# Altium schematic sheet Memory.SchDoc
size A4; SheetNumber: 5; SheetTotal: 9
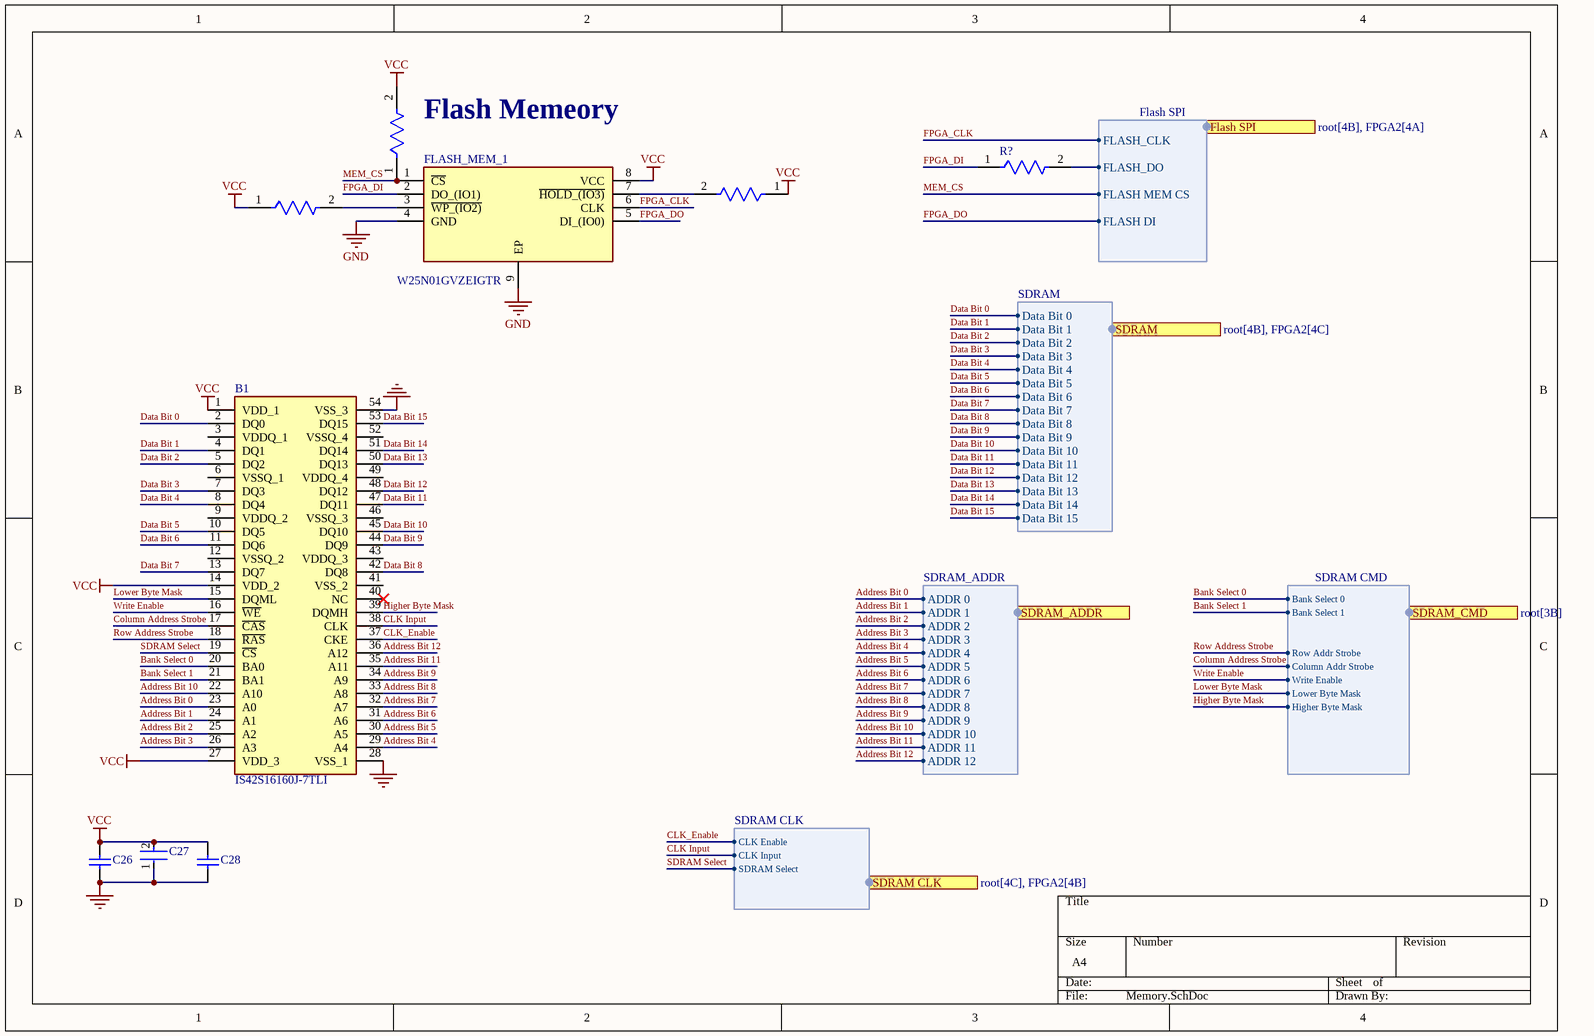
[diagram p0: Memory.SchDoc]

## Parts
(Parts that share a designator on the sheet are numbered #1, #2 ... from top to bottom, then left to right.)
B1  IS42S16160J-7TLI  [SOP80P1176X120-54N]
C26  LD033C104KAB2A  [CAPC1608X90X35NL15T15]  (value not drawn)
C27  GRM219R61E475MA73J  [FP-GRM219-0_15-0_1-IPC_B]  (value not drawn)
C28  C0603C105K9PACTU  [CAPC1608X90X35LL15T15]  (value not drawn)
FLASH_MEM_1  W25N01GVZEIGTR  [SON127P800X600X80-9N-D]
R?  RT0402BRE0750RL  [FP-RT0402-0_35-MFG]  (value not drawn)
R_?#1  RT0402BRE0710KL  [FP-RT0402-MFG]  (value not drawn)
R_?#2  RT0402BRE0710KL  [FP-RT0402-MFG]  (value not drawn)
R_?#3  RT0402BRE0710KL  [FP-RT0402-MFG]  (value not drawn)

## Ports
Flash SPI (harness Flash SPI, see root[4B], FPGA2[4A]), SDRAM (harness SDRAM, see root[4B], FPGA2[4C]), SDRAM CLK (harness SDRAM CLK, see root[4C], FPGA2[4B]), SDRAM_ADDR (harness SDRAM_ADDR, see root[4B], FPGA2[4C]), SDRAM_CMD (harness SDRAM CMD, see root[3B])

## Harnesses
Flash SPI: FLASH_CLK, FLASH_DO, FLASH MEM CS, FLASH DI
SDRAM: Data Bit 0, Data Bit 1, Data Bit 2, Data Bit 3, Data Bit 4, Data Bit 5, Data Bit 6, Data Bit 7, Data Bit 8, Data Bit 9, Data Bit 10, Data Bit 11, Data Bit 12, Data Bit 13, Data Bit 14, Data Bit 15
SDRAM_ADDR: ADDR 0, ADDR 1, ADDR 2, ADDR 3, ADDR 4, ADDR 5, ADDR 6, ADDR 7, ADDR 8, ADDR 9, ADDR 10, ADDR 11, ADDR 12
SDRAM CMD: Bank Select 0, Bank Select 1, Row Addr Strobe, Column Addr Strobe, Write Enable, Lower Byte Mask, Higher Byte Mask
SDRAM CLK: CLK Enable, CLK Input, SDRAM Select

## Nets
\: B1.1(VDD_1) B1.14(VDD_2) B1.27(VDD_3) C26.2 C27.2 C28.2 FLASH_MEM_1.8(VCC) R_?#1.2 R_?#2.1 R_?#3.1  [also labelled VCC]
GND: B1.28(VSS_1) B1.54(VSS_3) C26.1 C27.1 C28.1 FLASH_MEM_1.4(GND) FLASH_MEM_1.9(EP)
Address Bit 0: B1.23(A0) ; port SDRAM_ADDR.ADDR 0
Address Bit 1: B1.24(A1) ; port SDRAM_ADDR.ADDR 1
Address Bit 2: B1.25(A2) ; port SDRAM_ADDR.ADDR 2
Address Bit 3: B1.26(A3) ; port SDRAM_ADDR.ADDR 3
Address Bit 4: B1.29(A4) ; port SDRAM_ADDR.ADDR 4
Address Bit 5: B1.30(A5) ; port SDRAM_ADDR.ADDR 5
Address Bit 6: B1.31(A6) ; port SDRAM_ADDR.ADDR 6
Address Bit 7: B1.32(A7) ; port SDRAM_ADDR.ADDR 7
Address Bit 8: B1.33(A8) ; port SDRAM_ADDR.ADDR 8
Address Bit 9: B1.34(A9) ; port SDRAM_ADDR.ADDR 9
Address Bit 10: B1.22(A10) ; port SDRAM_ADDR.ADDR 10
Address Bit 11: B1.35(A11) ; port SDRAM_ADDR.ADDR 11
Address Bit 12: B1.36(A12) ; port SDRAM_ADDR.ADDR 12
Bank Select 0: B1.20(BA0) ; port SDRAM_CMD.Bank Select 0
Bank Select 1: B1.21(BA1) ; port SDRAM_CMD.Bank Select 1
CLK Input: B1.38(CLK) ; port SDRAM CLK.CLK Input
CLK_Enable: B1.37(CKE) ; port SDRAM CLK.CLK Enable
Column Address Strobe: B1.17(~{CAS}) ; port SDRAM_CMD.Column Addr Strobe
Data Bit 0: B1.2(DQ0) ; port SDRAM.Data Bit 0
Data Bit 1: B1.4(DQ1) ; port SDRAM.Data Bit 1
Data Bit 2: B1.5(DQ2) ; port SDRAM.Data Bit 2
Data Bit 3: B1.7(DQ3) ; port SDRAM.Data Bit 3
Data Bit 4: B1.8(DQ4) ; port SDRAM.Data Bit 4
Data Bit 5: B1.10(DQ5) ; port SDRAM.Data Bit 5
Data Bit 6: B1.11(DQ6) ; port SDRAM.Data Bit 6
Data Bit 7: B1.13(DQ7) ; port SDRAM.Data Bit 7
Data Bit 8: B1.42(DQ8) ; port SDRAM.Data Bit 8
Data Bit 9: B1.44(DQ9) ; port SDRAM.Data Bit 9
Data Bit 10: B1.45(DQ10) ; port SDRAM.Data Bit 10
Data Bit 11: B1.47(DQ11) ; port SDRAM.Data Bit 11
Data Bit 12: B1.48(DQ12) ; port SDRAM.Data Bit 12
Data Bit 13: B1.50(DQ13) ; port SDRAM.Data Bit 13
Data Bit 14: B1.51(DQ14) ; port SDRAM.Data Bit 14
Data Bit 15: B1.53(DQ15) ; port SDRAM.Data Bit 15
FPGA_CLK: FLASH_MEM_1.6(CLK) ; port Flash SPI.FLASH_CLK
FPGA_DI: FLASH_MEM_1.2(DO_(IO1)) R?.1
FPGA_DO: FLASH_MEM_1.5(DI_(IO0)) ; port Flash SPI.FLASH DI
Higher Byte Mask: B1.39(DQMH) ; port SDRAM_CMD.Higher Byte Mask
Lower Byte Mask: B1.15(DQML) ; port SDRAM_CMD.Lower Byte Mask
MEM_CS: FLASH_MEM_1.1(~{CS}) R_?#1.1 ; port Flash SPI.FLASH MEM CS
Row Address Strobe: B1.18(~{RAS}) ; port SDRAM_CMD.Row Addr Strobe
SDRAM Select: B1.19(~{CS}) ; port SDRAM CLK.SDRAM Select
Write Enable: B1.16(~{WE}) ; port SDRAM_CMD.Write Enable
NetFLASH_MEM_1_3: FLASH_MEM_1.3(~{WP_(IO2)}) R_?#3.2
NetFLASH_MEM_1_7: FLASH_MEM_1.7(~{HOLD_(IO3)}) R_?#2.2
NetR?_2: R?.2 ; port Flash SPI.FLASH_DO

Not connected (* = marked no-connect by the designer): B1 3(VDDQ_1) 6(VSSQ_1) 9(VDDQ_2) 12(VSSQ_2) 40(NC)* 41(VSS_2) 43(VDDQ_3) 46(VSSQ_3) 49(VDDQ_4) 52(VSSQ_4)

## Notes on the sheet
- (near R_?#1) Flash Memeory

## Library data of the parts
B1 = CMP-007-000000-1: DRAM 256M, 3.3V, SDRAM 16Mx16 143MHz; Manufacturer_Name: Integrated Silicon Solution Inc.; Geometry.Height: 1.2mm; Mouser Part Number: 870-IS42S16160J-7TLI; Mouser Price/Stock: https://www.mouser.co.uk/ProductDetail/ISSI/IS42S16160J-7TLI?qs=uCnMRCNammmen%252BmWnq1g5A%3D%3D; Source: IS42S16160J-7TLI.SchLib; Datasheet Link: http://www.issi.com/WW/pdf/42-45S83200J-16160J.pdf; Manufacturer_Part_Number: IS42S16160J-7TLI; Design Item ID: IS42S16160J-7TLI
C26 = CMP-2006-02157-1: Manufacturer: AVX Interconnect / Elco; Part Number: LD033C104KAB2A
C27 = CMP-06035-028467-1: Chip Multilayer Ceramic Capacitors for General Purpose, 0805, 4.7uF, X5R, 15%, 20%, 25V
C28 = CMP-2006-02241-1: Manufacturer: Kemet; Part Number: C0603C105K9PACTU
FLASH_MEM_1 = W25N01GVZEIGTR: Integrated Circuit; Manufacturer_Name: Winbond; Datasheet Link: http://www.winbond.com/resource-files/w25n01gv%20revl%20050918%20unsecured.pdf; Height: 0.8mm; Manufacturer_Part_Number: W25N01GVZEIGTR
R? = CMP-00621-71392720-1: RT0402BRE0750RL Fixed Resistor, Thin Film, 0.0625W, 50ohm, 50V, 0.1% +/-Tol, 50ppm/Cel, Surface Mount, 0402; Max Power Dissipation: 63mW; Temperature Coefficient: 50ppm/°C; Resistance: 50Ω; Features: Moisture Resistant; Max Operating Temperature: 155°C; Tolerance: 0.1%; Min Operating Temperature: -55°C; Case/Package: 0402; Packaging: Tape & Reel; RoHS: Compliant; Width: 508µm; Height: 355.6µm; NexarPartId: 71392720; Composition: Thin Film; Length: 990.6µm; Number of Terminations: 2
R_?#1-R_?#3 = CMP-2002-02973-2: RES SMD 10K OHM 0.1% 1/16W 0402; Manufacturer: Yageo; Power Rating: 0.063W; Resistance: 10KΩ; Temperature Coefficient: 50 ppm/°C; Tolerance: 0.001; Voltage Rating: 50V; Value: 10KΩ; Octopart: https://octopart.com/rt0402bre0710kl-yageo-1416557; Digikey Description: RES SMD 10K OHM 0.1% 1/16W 0402; Category: Res; Temperature Range Low: -55°C; Ipc Land Pattern Name: RESC10050X30; Manufacturer Part Number: RT0402BRE0710KL; Automotive: No; Package: RT0402; Temperature: -55°C to +155°C; Series: RT; Lead Free: Yes; Device Class L3: Chip SMD Resistors; ComponentLink2URL: http://www.yageo.com/documents/recent/PYu-RT_1-to-0.01_RoHS_L_9.pdf; Height: 0.35mm; ComponentLink2Description: Datasheet; RoHS: TRUE; Composition: Thin Film; Device Class L2: Resistors; Device Class L1: Passive Components; Temperature Range High: +155°C; Footprint Url: http://www.yageo.com/exep/pages/download/literatures/PYu-R_Mount_10.pdf; Mouser Description: Res Thin Film 0402 10K Ohm 0.1% 1/16W ±50ppm/°C Molded SMD Paper T/R